# Altium schematic sheet MCU_connector.SchDoc: foxBMS BMS-Interface
size A3; DocumentNumber: 2; SheetNumber: 2; SheetTotal: 6; Author: Fraunhofer IISB foxBMS Team; REL-DATE: 2017-05-09; VERSION: 1.1.0; GateName_1: G$1; SymbolName_1: FRAME_B_L; LibraryName: foxBMS_BMS-Master_V1.00_A; DeviceSetName: FRAME_B_L; GateName_2: G$2; SymbolName_2: DOCFIELD; SheetDescription: MCU connector
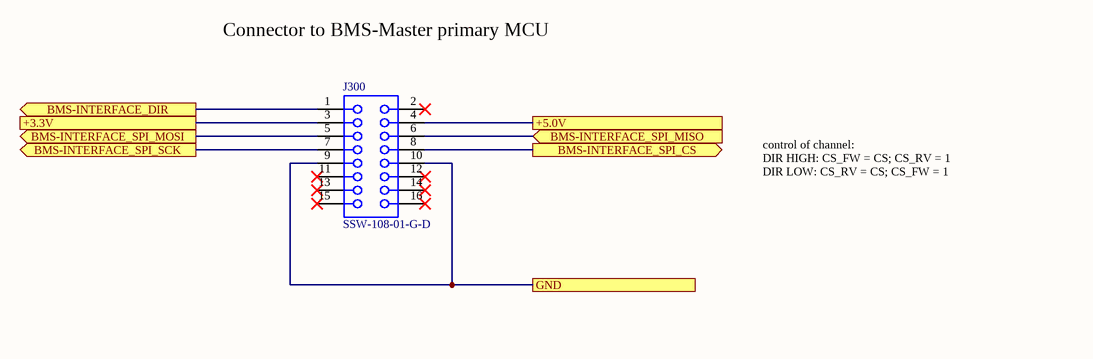
[diagram p0: MCU_connector.SchDoc]

## Parts
J300  SSW-108-01-G-D  [SMTC-SSW-108-01-X-D]

## Ports
+3.3V, +5.0V, BMS-INTERFACE_DIR (out), BMS-INTERFACE_SPI_CS (out), BMS-INTERFACE_SPI_MISO (in), BMS-INTERFACE_SPI_MOSI (out), BMS-INTERFACE_SPI_SCK (out), GND

## Nets
+3.3V: J300.3 ; port +3.3V
+5.0V: J300.4 ; port +5.0V
BMS-INTERFACE_DIR: J300.1 ; port BMS-INTERFACE_DIR
BMS-INTERFACE_SPI_CS: J300.8 ; port BMS-INTERFACE_SPI_CS
BMS-INTERFACE_SPI_MISO: J300.6 ; port BMS-INTERFACE_SPI_MISO
BMS-INTERFACE_SPI_MOSI: J300.5 ; port BMS-INTERFACE_SPI_MOSI
BMS-INTERFACE_SPI_SCK: J300.7 ; port BMS-INTERFACE_SPI_SCK
GND: J300.9 J300.10 ; port GND

Not connected (* = marked no-connect by the designer): J300 2* 11* 12* 13* 14* 15* 16*

## Notes on the sheet
- Connector to BMS-Master primary MCU
- control of channel:
  DIR HIGH: CS_FW = CS; CS_RV = 1
  DIR LOW: CS_RV = CS; CS_FW = 1
- Fraunhofer IISB
- Schottkystr. 10
- developed by:
- 91058 Erlangen
- Germany
- Author
- Project
- License
- Description
- File
- Version
- Release Date
- Sheet
- www.foxbms.org
- www.iisb.fraunhofer.de
- foxBMS Team
- /

## Library data of the parts
J300 = CMP-1023-00374-1: SQ Post Socket, Through-hole, Vertical, -55 to 125 degC, 2.54mm Pitch, 16-Pin, Female, RoHS; Manufacturer: Samtec; ComponentLink1Description: Manufacturer URL; DatasheetVersion: F-214; RoHS: True; Orientation: Vertical; Temperature Range: -55 to 125 degC; ComponentLink3URL: http://www.samtec.com/documents/webfiles/cpdf/SSW-1XX-XX-XXX-X-XX-XXX-XX-MKT.pdf; PackageReference: SSW-108-01-X-D; Mounting Technology: Through-hole; Pitch: 2.54 mm; ComponentLink1URL: http://www.samtec.com; ComponentLink2Description: Datasheet; PackageVersion: CA, 6/1987; PackageDescription: Assembly, Socket Strip .016 X .031 Tail; ComponentLink3Description: Package Specification; PartNumber: SSW-108-01-G-D; ComponentLink2URL: http://www.samtec.com/documents/webfiles/pdf/SSW_TH.PDF